# Altium schematic sheet Power Supply.SchDoc: Cypress Molson - Power Supply
size B; Author: G. Cosens; CompanyName: Linear Systems Ltd.; DrawnBy: G. Cosens; Engineer: G.Cosens; Organization: Linear Systems Ltd.; Address1: 1-1717 Dublin Ave.; Address2: Winnipeg, MB, Canada; Address3: R3H 0H2; DocumentNumber: LS7652; Revision: 1; SheetNumber: 12; SheetTotal: 12
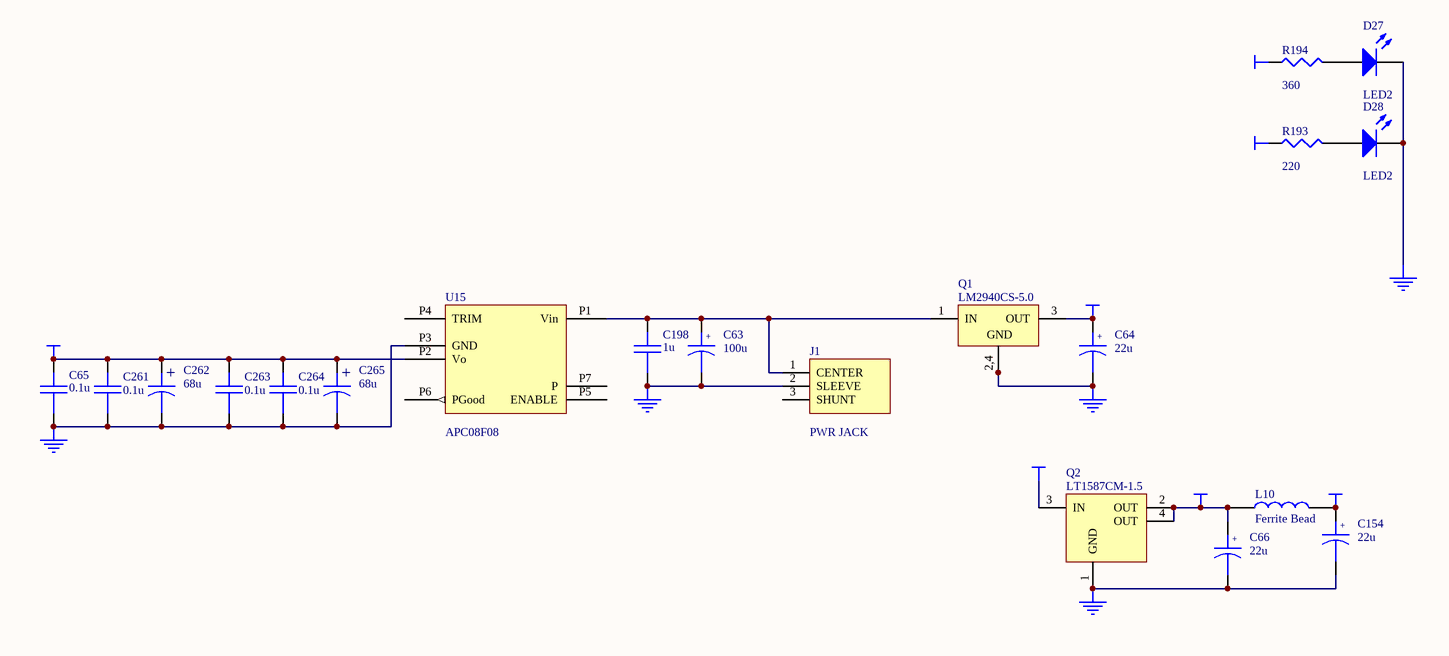
[diagram p0: Power Supply.SchDoc]

## Parts
C63  100u  [7343]
C64  22u  [6032]
C65  (no value)  [0603]
C66  22u  [6032]
C154  22u  [6032]
C198  (no value)  [0805]
C261  (no value)  [0603]
C262  68u  [6032]
C263  (no value)  [0603]
C264  (no value)  [0603]
C265  68u  [6032]
D27  LED2  [0603D]
D28  LED2  [0603D]
J1  PWR JACK  [RAPC712]
L10  Ferrite Bead  [0603]
Q1  LM2940CS-5.0  [SIP-G3/Y2.1]
Q2  LT1587CM-1.5  [DDPACK3]
R193  220  [0603]
R194  360  [0603]
U15  APC08F08  [APC08F08]

## Nets
+1.5V: C66.1 L10.1 Q2.2(OUT) Q2.4(OUT)
+1.5VA: C154.1 L10.2
+3.3V: C65.1 C261.1 C262.1 C263.1 C264.1 C265.1 Q2.3(IN) R193.1 U15.P2(Vo)
+5V: C64.1 Q1.3(OUT) R194.1
GND: C63.2 C64.2 C65.2 C66.2 C154.2 C198.2 C261.2 C262.2 C263.2 C264.2 C265.2 D27.2(K) D28.2(K) J1.2(SLEEVE) Q1.2(GND) Q1.4(GND) Q2.1(GND) U15.P3(GND)
NetC63_1: C63.1 C198.1 J1.1(CENTER) Q1.1(IN) U15.P1(Vin)
NetD27_1: D27.1(A) R194.2
NetD28_1: D28.1(A) R193.2

Not connected (* = marked no-connect by the designer): J1 3(SHUNT); U15 P4(TRIM) P5(ENABLE) P6(PGood) P7(P)

## Notes on the sheet
- Size
- Date:
- B
- Drawing Number
- Sheet
- Revision
- of
- File:
- Drawn By:
- G. Cosens
- (in symbol CAPACITOR POL) +
- (in symbol LM2940CS-5.0) 2,4

## Library data of the parts
C63 C64 C66 C154 C262 C265 = CAPACITOR POL: Text Field1: 20; Text Field2: 20
C65 C198 C261 C263 C264 = CAP: SMT CAP
D27 D28 = LED2: Typical RED, GREEN, YELLOW, AMBER GaAs LED; Manufacturer: Generic Components; Class I: Optoelectronic; Published: 8-Jun-2000; Revision: July-2002: Re-released for DXP Platform.; Publisher: Altium Limited; Class II: LED
J1 = PWR JACK: Power Jack
L10 = INDUCTOR1
Q1 = LM2940CS-5.0: 1A Low-Dropout Regulator; Manufacturer: National Semiconductor; Class I: Power Management; Class II: Voltage Regulator; Note: Tab is GND; Published: 15-Apr-2002; Datasheet: Latest Revision: Jun-1999; Package Reference: TS3B; Publisher: Altium Limited
Q2 = LT1587CM-1.5: 3-Terminal Positive Regulator; Manufacturer: National Semiconductor; Class I: Power Management; Class II: Voltage Regulator; Note: Tab is connected to GND; Published: 15-Apr-2002; Datasheet: Latest Revision: Apr-1998; Package Reference: TS3B; Publisher: Altium Limited
R193 R194 = RES1